# Altium schematic sheet DAC_1CH.SchDoc: Stabilizer
size 420 x 297 mm; Author: G.Kasprowicz; CompanyName: WUT ISE; DrawnBy: G.Kasprowicz; Organization: WUT ISE; Address1: PW ISE; Address2: Nowowiejska 15/19 00-665 Warsaw; Address3: gkasprow@gmail.com; DocumentNumber: 3; Revision: 3.4; SheetNumber: 3; SheetTotal: 11; ModifiedBy: -; CheckedDate: -; Title2: DAC & filter; DivGrp: WUT ISE; Designer: G.Kasprowicz; ModifiedDate: -; ProjectName: Sensor Box
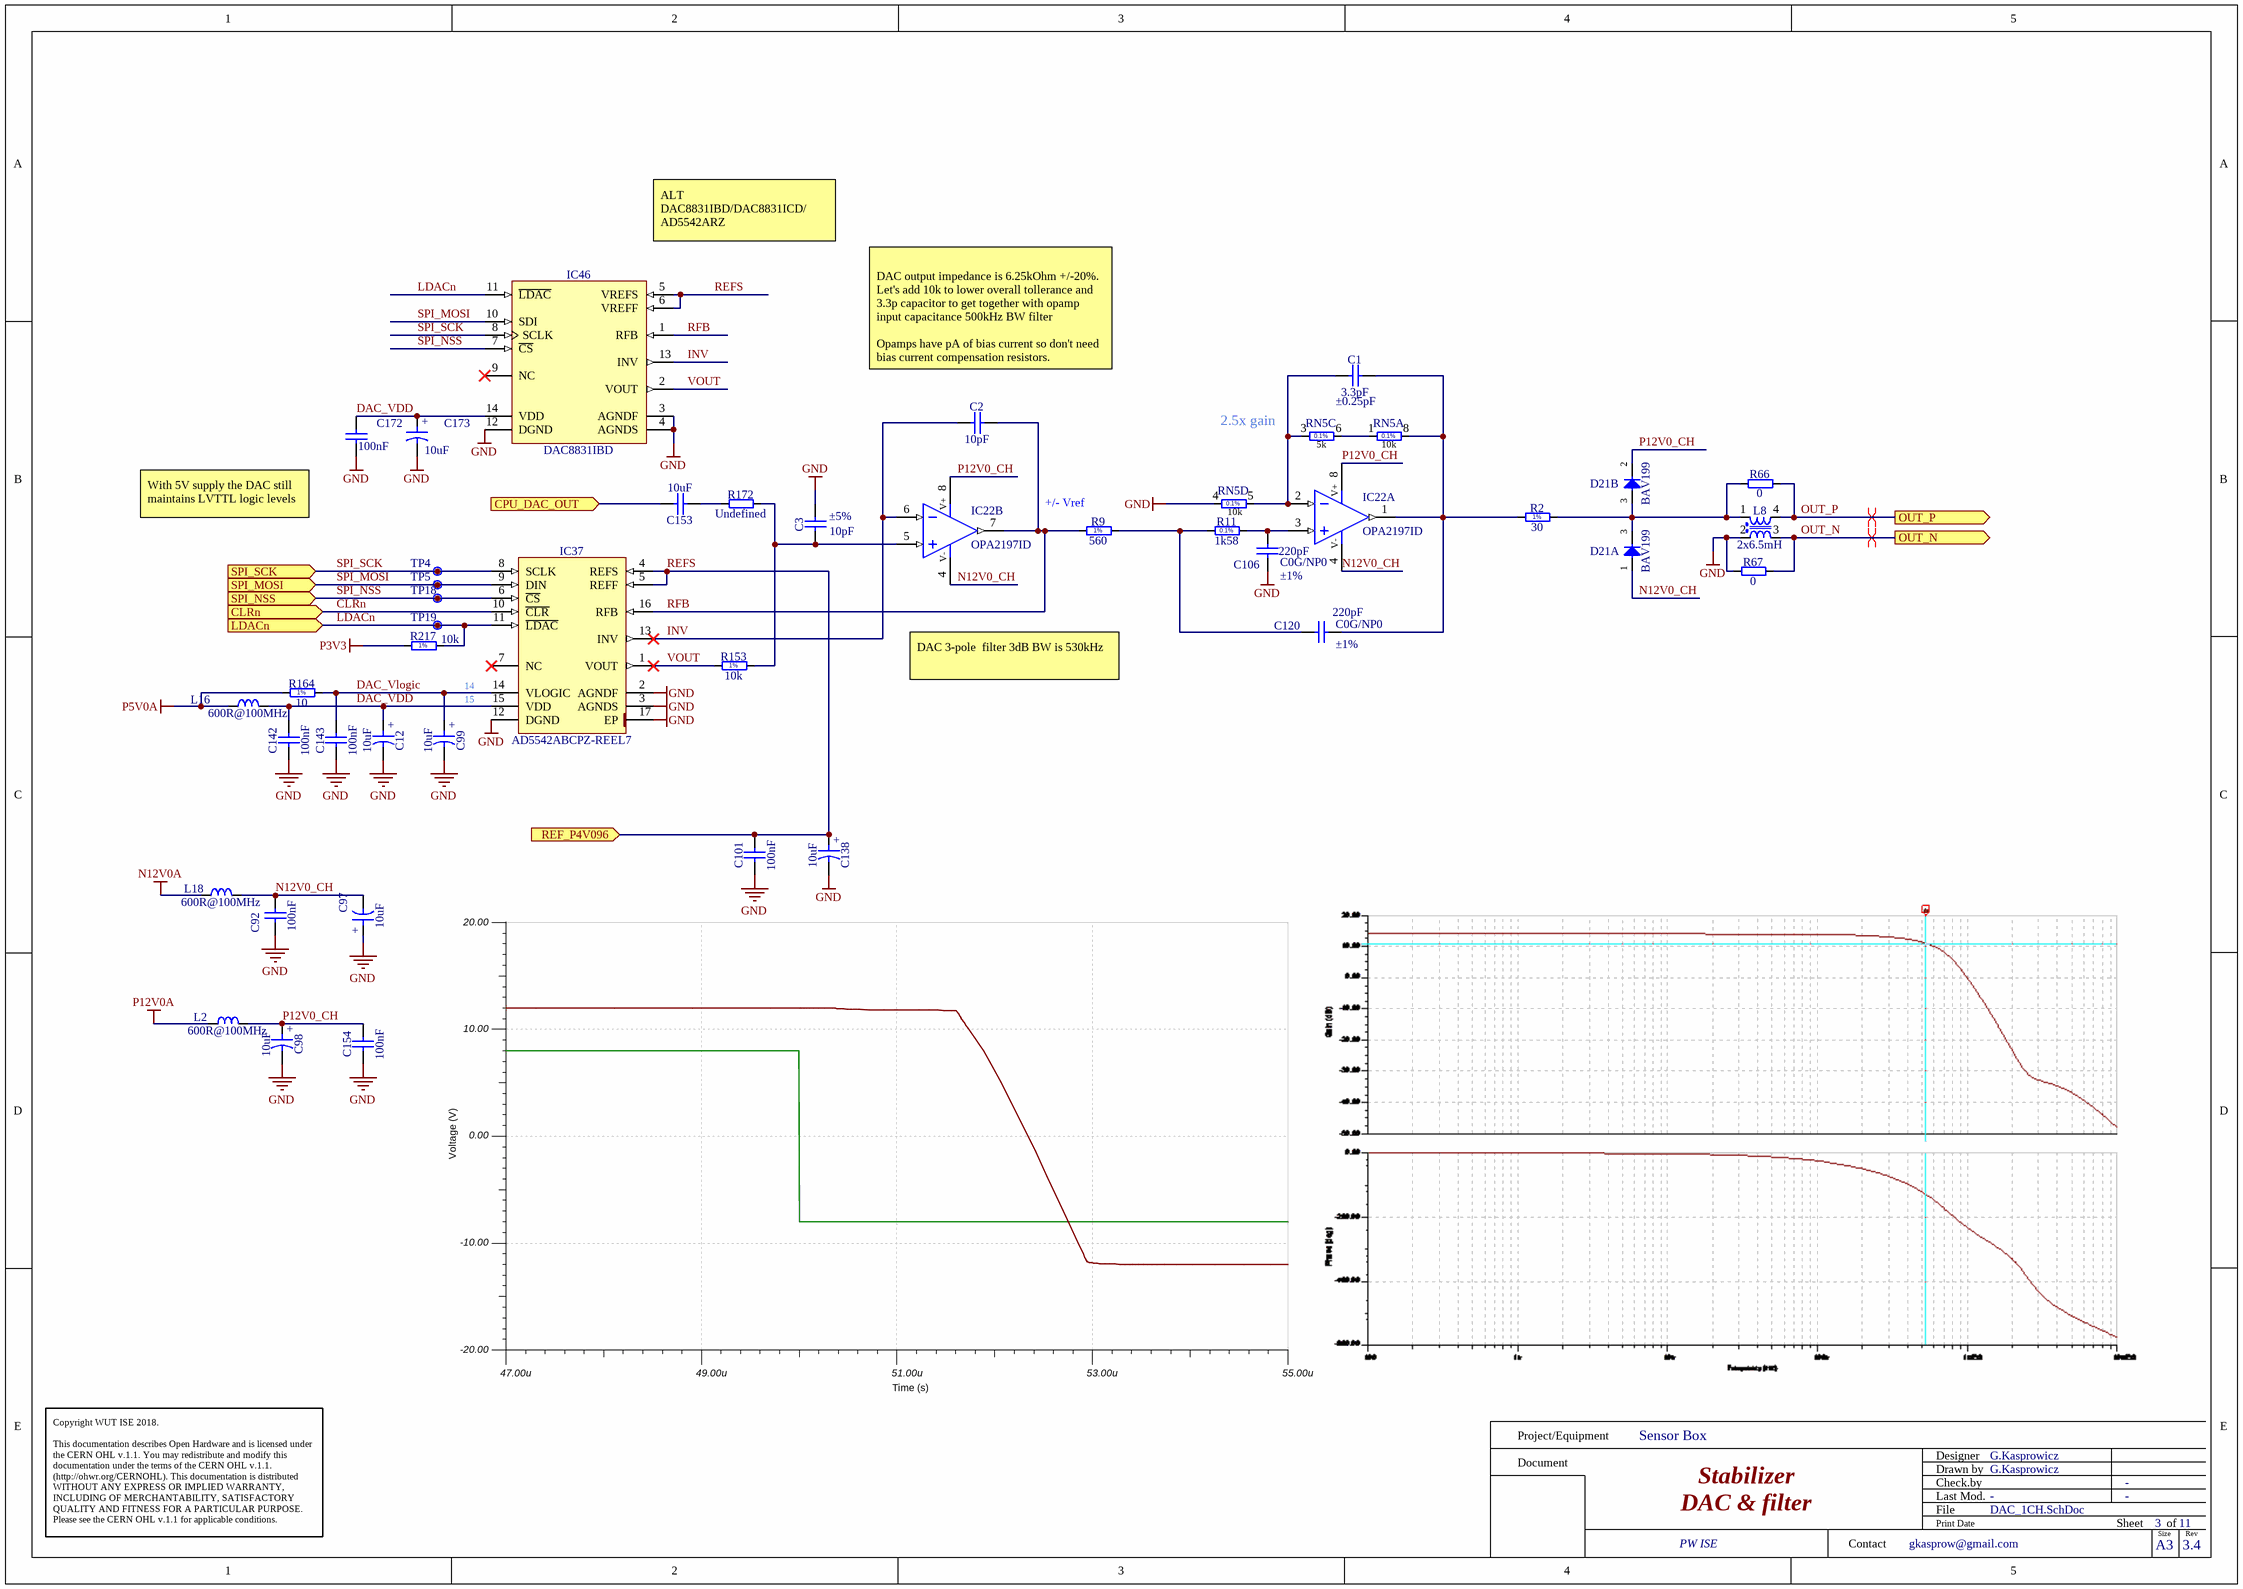
[diagram p0: DAC_1CH.SchDoc]

## Parts
C1  3.3pF  Tolerance: ±0.25pF  [CAPC1005X55N]
C2  10pF  [CAPC1005X55N]
C3  10pF  Tolerance: ±5%  [CAPC1005X55N]
C12  10uF  [CAPMP3216X180N]
C92  100nF  [CAPC1005X55N]
C97  10uF  [CAPMP3216X180N]
C98  10uF  [CAPMP3216X180N]
C99  10uF  [CAPMP3216X180N]
C101  100nF  [CAPC1005X55N]
C106  220pF  TC: C0G/NP0  Tolerance: ±1%  [CAPC2013X100N]
C120  220pF  TC: C0G/NP0  Tolerance: ±1%  [CAPC2013X100N]
C138  10uF  [CAPMP3216X180N]
C142  100nF  [CAPC1005X55N]
C143  100nF  [CAPC1005X55N]
C153  10uF  [CAPC2012X95N]
C154  100nF  [CAPC1005X55N]
C172  100nF  [CAPC1005X55N]
C173  10uF  [CAPMP3216X180N]
D21  BAV199  [SOT95P240X110-3N]  (parts A,B of 2)
IC22  OPA2197ID  [SOIC127P600X175-8N]  (parts A,B of 2)
IC37  AD5542ABCPZ-REEL7  [QFN50P300X300X80-17N-S175]
IC46  DAC8831IBD  [SOIC127P600X175-14N]
L2  600R@100MHz  [INDC1005X55N]
L8  2x6.5mH  [IND_WURTH_WE-SL2]
L16  600R@100MHz  [INDC1005X55N]
L18  600R@100MHz  [INDC1005X55N]
R2  30  [RESC1608X55N]
R9  560  [RESC1608X55N]
R11  1k58  [RESC1608X55N]
R66  0  [RESC1608X55N]
R67  0  [RESC1608X55N]
R153  10k  [RESC1005X40N]
R164  10  [RESC1005X40N]
R172  Undefined  [RESC1608X55N]
R217  10k  [RESC1005X40N]
RN5  10k 5K 5K 10K  [SOIC127P600X175-8N]  (value not drawn)  (parts A,C,D of 4)
TP4  Test Point  [TPS127]  (value not drawn)
TP5  Test Point  [TPS127]  (value not drawn)
TP18  Test Point  [TPS127]  (value not drawn)
TP19  Test Point  [TPS127]  (value not drawn)

## Ports
CLRn (in), CPU_DAC_OUT (in), LDACn (in), OUT_N (out), OUT_P (out), REF_P4V096 (in), SPI_MOSI (in), SPI_NSS (in), SPI_SCK (in)

## Nets
GND: C3.2 C12.2 C92.1 C97.1 C98.2 C99.2 C101.1 C106.1 C138.2 C142.1 C143.1 C154.1 C172.1 C173.2 IC37.2(AGNDF) IC37.3(AGNDS) IC37.12(DGND) IC37.17(EP) IC46.3(AGNDF) IC46.4(AGNDS) IC46.12(DGND) L8.2 R67.1 RN5.4
N12V0A: L18.1
P3V3: R217.1
P5V0A: L16.1 R164.1
P12V0A: L2.1
CLRn: IC37.10(~{CLR}) ; port CLRn
CPU_DAC_OUT: C153.2 ; port CPU_DAC_OUT
DAC_VDD: C12.1 C142.2 C172.2 C173.1 IC37.15(VDD) IC46.14(VDD) L16.2
DAC_Vlogic: C99.1 C143.2 IC37.14(VLOGIC) R164.2
INV: C2.1 IC22.6(IN-) IC37.13(INV) IC46.13(INV)
LDACn: IC37.11(~{LDAC}) IC46.11(~{LDAC}) R217.2 TP19.1 ; port LDACn
N12V0_CH: C92.2 C97.2 D21.1(A) IC22.4(V-) L18.2
OUT_N: L8.3 R67.2 ; port OUT_N
OUT_P: L8.4 R66.2 ; port OUT_P
P12V0_CH: C98.1 C154.2 D21.2(C) IC22.8(V+) L2.2
REFS: C101.2 C138.1 IC37.4(REFS) IC37.5(REFF) IC46.5(VREFS) IC46.6(VREFF) ; port REF_P4V096
RFB: C2.2 IC22.7(OUT) IC37.16(RFB) IC46.1(RFB) R9.1
SPI_MOSI: IC37.9(DIN) IC46.10(SDI) TP5.1 ; port SPI_MOSI
SPI_NSS: IC37.6(~{CS}) IC46.7(~{CS}) TP18.1 ; port SPI_NSS
SPI_SCK: IC37.8(SCLK) IC46.8(SCLK) TP4.1 ; port SPI_SCK
VOUT: IC37.1(VOUT) IC46.2(VOUT) R153.1
NetC1_1: C1.1 IC22.2(IN-) RN5.3 RN5.5
NetC1_2: C1.2 C120.2 IC22.1(OUT) R2.1 RN5.8
NetC3_1: C3.1 IC22.5(IN+) R153.2 R172.2
NetC106_2: C106.2 IC22.3(IN+) R11.2
NetC120_1: C120.1 R9.2 R11.1
NetC153_1: C153.1 R172.1
NetD21_3: D21.3(COMAC) L8.1 R2.2 R66.1
NetRN5_1: RN5.1 RN5.6

Not connected (* = marked no-connect by the designer): IC37 7(NC)*; IC46 9(NC)*

## Layout directives
differential pair: OUT_N, OUT_P

## Notes on the sheet
- ALT DAC8831IBD/DAC8831ICD/ AD5542ARZ
- DAC output impedance is 6.25kOhm +/-20%.
  Let's add 10k to lower overall tollerance and 3.3p capacitor to get together with opamp input capacitance 500kHz BW filter
  Opamps have pA of bias current so don't need bias current compensation resistors.
- (near RN5) 2.5x gain
- With 5V supply the DAC still maintains LVTTL logic levels
- (near R9) +/- Vref
- 14
- 15
- DAC 3-pole  filter 3dB BW is 530kHz
- Project/Equipment
- Document
- Designer
- Drawn by
- Check.by
- Copyright WUT ISE 2018.
  This documentation describes Open Hardware and is licensed under the CERN OHL v.1.1. You may redistribute and modify this documentation under the terms of the CERN OHL v.1.1. (http://ohwr.org/CERNOHL). This documentation is distributed WITHOUT ANY EXPRESS OR IMPLIED WARRANTY, INCLUDING OF MERCHANTABILITY, SATISFACTORY QUALITY AND FITNESS FOR A PARTICULAR PURPOSE. Please see the CERN OHL v.1.1 for applicable conditions.
- Contact
- File
- Last Mod.
- Print Date
- Sheet
- Size
- A3
- of
- Rev
- (in symbol CTE3216-18_10UF_16V_20%_AVX_TCJ) +
- (in symbol R0402_10K_1%_0.0625W_100PPM) 1%
- (in symbol R0402_10R_1%_0.0625W_200PPM) 1%
- (in symbol R0603_1K58_0.1%_0.063W_10PPM) 0.1%
- (in symbol R0603_30R_1%_0.1W_100PPM) 1%
- (in symbol R0603_560R_1%_0.1W_100PPM) 1%
- (in symbol RN_10K_5K_VISHAY_AORN2-1AT3, part A) 10k
- (in symbol RN_10K_5K_VISHAY_AORN2-1AT3, part C) 5k
- (in symbol RN_10K_5K_VISHAY_AORN2-1AT3, part D) 10k

## Library data of the parts
C1 = CC0402_3.3PF_50V_0.25PF_C0G: Non-polarised capacitor; Part Description: SMD Multilayer Chip Ceramic Capacitor; Manufacturer: GENERIC; Manufacturer1 Part Number: C0402C339C5GACTU; Voltage: 50V; TC: C0G/NP0; Part Number: CC0402_3.3PF_50V_0.25PF_C0G; Component Kind: Standard; Component Type: Standard; Pin Count: 2; Value: 3.3pF; Status: Preferred; Manufacturer Part Number: CC0402_3.3PF_50V_0.25PF_C0G; Case: 0402; Mounted: Yes; Socket: No; SMD: Yes; Sense: No; HelpURL: \\cern.ch\dfs\Applications\Altium\Datasheets\CC0402_C0G_KEMET_(Commercial Grade).pdf; Author: CERN DEM JLC; CreateDate: 03.12.2007; LatestRevisionDate: 22.04.2015; Manufacturer1 Example: KEMET; Manufacturer1 ComponentHeight: 0.55mm
C2 = CC0402_10PF_50V_5%_C0G: Non-polarised capacitor; Part Description: SMD Multilayer Chip Ceramic Capacitor; Manufacturer: GENERIC; Manufacturer1 Part Number: C0402C100J5GACTU; Voltage: 50V; TC: C0G/NP0; Tolerance: ±5%; Part Number: CC0402_10PF_50V_5%_C0G; Component Kind: Standard; Component Type: Standard; Pin Count: 2; Value: 10pF; Status: Preferred; Manufacturer Part Number: CC0402_10PF_50V_5%_C0G; Case: 0402; Mounted: Yes; Socket: No; SMD: Yes; Sense: No; Manufacturer1 Example: KEMET; Manufacturer1 ComponentHeight: 0.55mm; HelpURL: \\cern.ch\dfs\Applications\Altium\Datasheets\CC0805_C0G_KEMET_(Commercial Grade).pdf; Author: CERN DEM JLC; CreateDate: 03.12.2007; LatestRevisionDate: 22.04.2015
C3 = CC0402_10PF_50V_5%_C0G: Non-polarised capacitor; Part Description: SMD Multilayer Chip Ceramic Capacitor; Manufacturer: GENERIC; Manufacturer1 Part Number: C0402C100J5GACTU; Voltage: 50V; TC: C0G/NP0; Part Number: CC0402_10PF_50V_5%_C0G; Component Kind: Standard; Component Type: Standard; Pin Count: 2; Value: 10pF; Status: Preferred; Manufacturer Part Number: CC0402_10PF_50V_5%_C0G; Case: 0402; Mounted: Yes; Socket: No; SMD: Yes; Sense: No; HelpURL: \\cern.ch\dfs\Applications\Altium\Datasheets\CC0805_C0G_KEMET_(Commercial Grade).pdf; Author: CERN DEM JLC; CreateDate: 03.12.2007; LatestRevisionDate: 22.04.2015; Manufacturer1 Example: KEMET; Manufacturer1 ComponentHeight: 0.55mm
C12 C97-C99 C138 C173 = CTE3216-18_10UF_16V_20%_AVX_TCJ: Polarised capacitor; Part Description: ESR 0R200 Tantalum Solid Electrolytic Chip Capacitor with Conductive Polymer Electrode; Manufacturer: AVX; Manufacturer Part Number: TCJA106M016R0200; Voltage: 16V; Tolerance: ±20%; Part Number: CTE3216-18_10UF_16V_20%_AVX_TCJ; Component Kind: Standard; Component Type: Standard; Pin Count: 2; Value: 10uF; Status: Preferred; Case: A; Mounted: Yes; Socket: No; SMD: Yes; Sense: No; ComponentHeight: 1.8mm; HelpURL: \\cern.ch\dfs\Applications\Altium\Datasheets\CTE_AVX_TCJ.pdf; Author: CERN DEM JLC; CreateDate: 29.03.2012; LatestRevisionDate: 29.03.2012
C92 C101 C142 C143 C154 C172 = CC0402_100NF_16V_10%_X7R: Non-polarised capacitor; Part Description: SMD Multilayer Chip Ceramic Capacitor; Manufacturer: GENERIC; Manufacturer1 Part Number: GRM155R71C104KA88D; Voltage: 16V; TC: X7R; Tolerance: ±10%; Part Number: CC0402_100NF_16V_10%_X7R; Component Kind: Standard; Component Type: Standard; Pin Count: 2; Value: 100nF; Status: Not Recommended; Manufacturer Part Number: CC0402_100NF_16V_10%_X7R; Case: 0402; Mounted: Yes; Socket: No; SMD: Yes; Sense: No; Manufacturer1 Example: MURATA; Manufacturer1 ComponentHeight: 0.55mm; HelpURL: \\cern.ch\dfs\Applications\Altium\Datasheets\CC0402_X7R_MURATA_GRM.pdf; Author: CERN DEM JLC; CreateDate: 2013-12-05; LatestRevisionDate: 2007-12-03
C106 C120 = CC0805_220PF_25V_1%_C0G: Non-polarised capacitor; Part Description: SMD Multilayer Chip Ceramic Capacitor; Manufacturer: GENERIC; Manufacturer1 Part Number: C0805C221F3GACTU; Voltage: 25V; Part Number: CC0805_220PF_25V_1%_C0G; Component Kind: Standard; Component Type: Standard; Pin Count: 2; Value: 220pF; Status: None; Manufacturer Part Number: CC0805_220PF_25V_1%_C0G; Case: 0805; Mounted: Yes; Socket: No; SMD: Yes; Sense: No; Manufacturer1 Example: KEMET; Manufacturer1 ComponentHeight: 0.88mm; HelpURL: \\cern.ch\dfs\Applications\Altium\Datasheets\CC0805_C0G_KEMET_(Commercial Grade).pdf; Author: CERN DEM JLC; CreateDate: 11.03.2015; LatestRevisionDate: 11.03.2015
C153 = CC0805_10UF_25V_10%_X5R: Non-polarised capacitor; Part Description: SMD Multilayer Chip Ceramic Capacitor; Manufacturer: GENERIC; Manufacturer1 Part Number: GRM219R61E106KA12D; Voltage: 25V; TC: X5R; Tolerance: ±10%; Part Number: CC0805_10UF_25V_10%_X5R; Component Kind: Standard; Component Type: Standard; Pin Count: 2; Value: 10uF; Status: Preferred; Manufacturer Part Number: CC0805_10UF_25V_10%_X5R; Case: 0805; Mounted: Yes; Socket: No; SMD: Yes; Sense: No; Manufacturer1 Example: MURATA; Manufacturer1 ComponentHeight: 0.95mm; HelpURL: \\cern.ch\dfs\Applications\Altium\Datasheets\CC0805_X5R_MURATA_GRM.pdf; Author: CERN DEM JLC; CreateDate: 25.10.2012; LatestRevisionDate: 06.09.2016
D21 = BAV199: Serial Diode; Part Description: Low-Leakage Double Diode; Manufacturer: NXP SEMICONDUCTORS; Voltage: 75V; Power: 250mW; PressFit: No; Bonding: No; Part Number: BAV199; Component Kind: Standard; Component Type: Standard; Device: BAV199; PackageDescription: SOT23 3-Leads, Pitch 0.95mm - Body 1.4x3mm, IPC Medium Density; Manufacturer Part Number: BAV199; Pin Count: 3; Case: SOT23-3; Mounted: Yes; Socket: No; SMD: Yes; Sense: No; ComponentHeight: 1.1mm; HelpURL: \\cern.ch\dfs\Applications\Altium\Datasheets\BAV199.pdf; Author: CERN DEM JMW; CreateDate: 2008-11-21; LatestRevisionDate: 2008-11-21
IC22 = OPA2197ID: Dual Operational Amplifier; Part Description: Dual, 36-V, Precision, Rail-to-Rail Input/Output, Low Offset Voltage, Operational Amplifiers; Manufacturer: TEXAS INSTRUMENTS; PressFit: No; Bonding: No; Part Number: OPA2197ID; Component Kind: Standard; Component Type: Standard; Device: OPA2197ID; PackageDescription: SOIC 8, Pitch 1.27mm - Body 4x5mm, IPC Medium Density; Manufacturer Part Number: OPA2197ID; Pin Count: 8; Case: SOIC8; Mounted: Yes; Socket: No; SMD: Yes; Sense: No; ComponentHeight: 1.75mm; Author: CERN DEM MR; HelpURL: \\cern.ch\dfs\Applications\Altium\Datasheets\OPA2197ID.pdf; CreateDate: 07.08.2019; LatestRevisionDate: 07.08.2019
IC37 = AD5542ABCPZ-REEL7: 2.7V to 5.5V, Serial-Input, Voltage-Output, 16-Bit DAC; Manufacturer: ANALOG DEVICES; PressFit: No; Bonding: No; Part Number: AD5542ABCPZ-REEL7; Component Kind: Standard; Component Type: Standard; Device: AD5542ABCPZ-REEL7; PackageDescription: QFN, 0.50mm Pitch, Square; 16 Pin, 3.00mm L X 3.00mm W X 0.80mm H Body (w/Thermal Tab 1.75 X 1.75mm),  IPC Medium Density; Part Description: 2.7V to 5.5V, Serial-Input, Voltage-Output, 16-Bit DAC; Manufacturer Part Number: AD5542ABCPZ-REEL7; Pin Count: 17; Case: QFN16; Mounted: Yes; Socket: No; SMD: Yes; Sense: No; ComponentHeight: 0.8mm; Author: CERN DEM JLC; HelpURL: \\cern.ch\dfs\Applications\Altium\Datasheets\AD5542ABCPZ-REEL7.pdf; CreateDate: 29.11.2018; LatestRevisionDate: 29.11.2018
IC46 = DAC8831ICD: 16-Bit, Ultra-Low Power, Voltage-Output Digital-to-Analog Converter; Manufacturer: TEXAS INSTRUMENTS; PressFit: No; Bonding: No; Part Number: DAC8831IBD; Component Kind: Standard; Component Type: Standard; Device: DAC8831IBD; PackageDescription: SOIC 14, Pitch 1.27mm - Body 4x8.75mm, IPC Medium Density; Part Description: 16-Bit, Ultra-Low Power, Voltage-Output Digital-to-Analog Converter; Manufacturer Part Number: DAC8831IBD; Pin Count: 14; Case: SOIC14; Mounted: Yes; Socket: No; SMD: Yes; Sense: No; ComponentHeight: 1.75mm; Author: GK; HelpURL: \\cern.ch\dfs\Applications\Altium\Datasheets\DAC8831ICD.pdf; CreateDate: 21.02.2013; LatestRevisionDate: 21.02.2013
L2 L16 L18 = IND0402_MURATA_BLM15HD601SN1: Inductor; Part Description: SMD EMIFIL Suppression Chip Ferrite Bead; Manufacturer: MURATA; Manufacturer Part Number: BLM15HD601SN1D; Power: 300mA; Resistance: 0.85R; Tolerance: ±25%; Part Number: IND0402_MURATA_BLM15HD601SN1; Component Kind: Standard; Component Type: Standard; Pin Count: 2; Value: 600R@100MHz; Status: None; Case: 0402; Mounted: Yes; Socket: No; SMD: Yes; Sense: No; ComponentHeight: 0.55mm; HelpURL: \\cern.ch\dfs\Applications\Altium\Datasheets\IND0402_MURATA_BLM15H.pdf; Author: CERN DEM JLC; CreateDate: 28/02/2012; LatestRevisionDate: 28/02/2012
L8 = IND_6.5MH_50%_WURTH_WE-SL2-744229: Inductor Common Mode; Part Description: Common Mode SMD Line Filter (WE-SL2 Serie); Manufacturer: WURTH ELEKTRONIK; Manufacturer Part Number: 744229; Power: 400mA; Resistance: 0.95R; Tolerance: ±50%; Part Number: IND_6.5MH_50%_WURTH_WE-SL2-744229; Component Kind: Standard; Component Type: Standard; Pin Count: 4; Value: 2x6.5mH; Status: None; Mounted: Yes; Socket: No; SMD: Yes; Sense: No; ComponentHeight: 5.3mm; HelpURL: \\cern.ch\dfs\Applications\Altium\Datasheets\IND_WURTH_WE-SL2_744229.pdf; Author: CERN DEM JLC; CreateDate: 01.10.2012; LatestRevisionDate: 15.10.2012
R2 = R0603_30R_1%_0.1W_100PPM: Resistor - 1%; Part Description: General Purpose Thick Film Chip Resistor; Manufacturer: GENERIC; Manufacturer1 Part Number: NRC06F30R0TRF; Power: 0.1W; TC: ±100ppm/°C; PressFit: No; Part Number: R0603_30R_1%_0.1W_100PPM; Component Kind: Standard; Component Type: Standard; Pin Count: 2; Value: 30; Status: Preferred; Tolerance: ±1%; Manufacturer Part Number: R0603_30R_1%_0.1W_100PPM; Case: 0603; Mounted: Yes; Sense: No; Socket: No; SMD: Yes; Manufacturer1 Example: NIC COMPONENT; Manufacturer1 ComponentHeight: 0.55mm; HelpURL: \\cern.ch\dfs\Applications\Altium\Datasheets\R0603_NIC_NRC.pdf; Author: CERN DEM JLC; CreateDate: 03/12/2007; LatestRevisionDate: 13/03/2008
R9 = R0603_560R_1%_0.1W_100PPM: Resistor - 1%; Part Description: General Purpose Thick Film Chip Resistor; Manufacturer: GENERIC; Manufacturer1 Part Number: NRC06F5600TRF; Power: 0.1W; TC: ±100ppm/°C; PressFit: No; Part Number: R0603_560R_1%_0.1W_100PPM; Component Kind: Standard; Component Type: Standard; Pin Count: 2; Value: 560; Status: Preferred; Tolerance: ±1%; Manufacturer Part Number: R0603_560R_1%_0.1W_100PPM; Case: 0603; Mounted: Yes; Sense: No; Socket: No; SMD: Yes; Manufacturer1 Example: NIC COMPONENT; Manufacturer1 ComponentHeight: 0.55mm; HelpURL: \\cern.ch\dfs\Applications\Altium\Datasheets\R0603_NIC_NRC.pdf; Author: CERN DEM JLC; CreateDate: 03.12.2007; LatestRevisionDate: 13.03.2008
R11 = R0603_1K58_0.1%_0.063W_10PPM: Resistor - 0.1%; Part Description: Thin Film Chip Resistor; Manufacturer: GENERIC; Manufacturer1 Part Number: RN73C1J1K58BTDF; Power: 0.063W; TC: ±10ppm; PressFit: No; Part Number: R0603_1K58_0.1%_0.063W_10PPM; Component Kind: Standard; Component Type: Standard; Pin Count: 2; Value: 1k58; Status: Not Recommended; Tolerance: ±0.1%; Manufacturer Part Number: R0603_1K58_0.1%_0.063W_10PPM; Case: 0603; Mounted: Yes; Sense: No; Socket: No; SMD: Yes; Manufacturer1 Example: TYCO HOLSWORTHY; Manufacturer1 ComponentHeight: 0.5mm; HelpURL: \\cern.ch\dfs\Applications\Altium\Datasheets\R0603_Tyco_RN73.pdf; Author: CERN DEM JLC; CreateDate: 03.12.2007; LatestRevisionDate: 13.03.2008
R66 R67 = R0603_0R_JUMPER: Resistor; Part Description: 1A (0.05R Max DC Resistance) Zero Ohm Jumper; Manufacturer: GENERIC; Manufacturer1 Part Number: NRC06Z0; PressFit: No; Part Number: R0603_0R_JUMPER; Component Kind: Standard; Component Type: Standard; Pin Count: 2; Value: 0; Status: Preferred; Manufacturer Part Number: R0603_0R_JUMPER; Case: 0603; Mounted: Yes; Sense: No; Socket: No; SMD: Yes; Manufacturer1 Example: NIC COMPONENT; Manufacturer1 ComponentHeight: 0.55mm; HelpURL: \\cern.ch\dfs\Applications\Altium\Datasheets\R0603_NIC_NRC.pdf; Author: CERN DEM JLC; CreateDate: 03.12.2007; LatestRevisionDate: 13.03.2008
R153 R217 = R0402_10K_1%_0.0625W_100PPM: Resistor - 1%; Part Description: General Purpose Thick Film Chip Resistor; Manufacturer: GENERIC; Manufacturer1 Part Number: 232270671003L; TC: ±100ppm/°C; PressFit: No; Part Number: R0402_10K_1%_0.0625W_100PPM; Component Kind: Standard; Component Type: Standard; Pin Count: 2; Value: 10k; Status: Not Recommended; Power: 0.0625W; Tolerance: ±1%; Manufacturer Part Number: R0402_10K_1%_0.0625W_100PPM; Case: 0402; Mounted: Yes; Sense: No; Socket: No; SMD: Yes; Manufacturer1 Example: YAGEO PHYCOMP; Manufacturer1 ComponentHeight: 0.4mm; HelpURL: \\cern.ch\dfs\Applications\Altium\Datasheets\R0402_Phycomp_RC0402.pdf; Author: CERN DEM JLC; CreateDate: 03.12.2007; LatestRevisionDate: 17.10.2012
R164 = R0402_10R_1%_0.0625W_200PPM: Resistor - 1%; Part Description: General Purpose Thick Film Chip Resistor; Manufacturer: GENERIC; Manufacturer1 Part Number: 232270671009L; TC: ±200ppm/°C; PressFit: No; Part Number: R0402_10R_1%_0.0625W_200PPM; Component Kind: Standard; Component Type: Standard; Pin Count: 2; Value: 10; Status: Not Recommended; Power: 0.0625W; Tolerance: ±1%; Manufacturer Part Number: R0402_10R_1%_0.0625W_200PPM; Case: 0402; Mounted: Yes; Sense: No; Socket: No; SMD: Yes; Manufacturer1 Example: YAGEO PHYCOMP; Manufacturer1 ComponentHeight: 0.4mm; HelpURL: \\cern.ch\dfs\Applications\Altium\Datasheets\R0402_Phycomp_RC0402.pdf; Author: CERN DEM JLC; CreateDate: 24.06.2009; LatestRevisionDate: 17.10.2012
R172 = R0603_NO-VALUE: Resistor; Part Description: Reserved Footprint For a 0603 (1608) Chip Resistor; PressFit: No; Mounted: No; Part Number: R0603_NO-VALUE; Component Kind: Standard; Component Type: Standard; Pin Count: 2; Value: Undefined; Status: None; Manufacturer: Undefined; Manufacturer Part Number: R0603_NO-VALUE; Case: 0603; Sense: No; Socket: No; SMD: Yes; Manufacturer1 Example: Undefined; Manufacturer1 Part Number: Undefined; Manufacturer1 ComponentHeight: Undefined; HelpURL: Undefined; Author: CERN DEM JLC; CreateDate: 03.12.2007; LatestRevisionDate: 13.03.2008
RN5 = RN_10K_5K_VISHAY_AORN2-1AT3: DIL8 Resistor Network 4 Resistors 10k-5k-5k-10k 0.1%; Part Description: Dual-In-Line Thin Film Precision Automotive Resistors Network, (4 Isolated) - AORN Series; Manufacturer: VISHAY DALE; Power: 4x0.1W; TC: ±25ppm/°C; PressFit: No; Part Number: RN_10K_5K_VISHAY_AORN2-1AT3; Component Kind: Standard; Component Type: Standard; Pin Count: 8; Value: 10k 5K 5K 10K; Sense: No; Tolerance: 0.1%; Manufacturer Part Number: AORN2-1AT3; Case: SOIC8; Mounted: Yes; Socket: No; SMD: Yes; ComponentHeight: 1.73mm; HelpURL: \\cern.ch\dfs\Applications\Altium\Datasheets\RN_VISHAY_AORN.pdf; Author: CERN DEM JLC; CreateDate: 20.02.2017; LatestRevisionDate: 20.02.2017
TP4 TP5 TP18 TP19 = SMD_PAD_1.27X1.27MM: Part Description: 1.27mm x 1.27mm PCB Copper Area (SMD Test Point); Mounted: No; Part Number: SMD_PAD_1.27X1.27MM; Component Kind: Standard (No BOM); Component Type: Standard (No BOM); Pin Count: 1; Family: Test Point; Socket: No; SMD: Yes; Sense: No; Status: None; ComponentHeight: 0mm; HelpURL: Undefined; Author: CERN DEM JLC; CreateDate: 12.01.2008; LatestRevisionDate: 12.01.2008; PackageDescription: 1.27mm x 1.27mm PCB Copper Area (SMD Test Point)